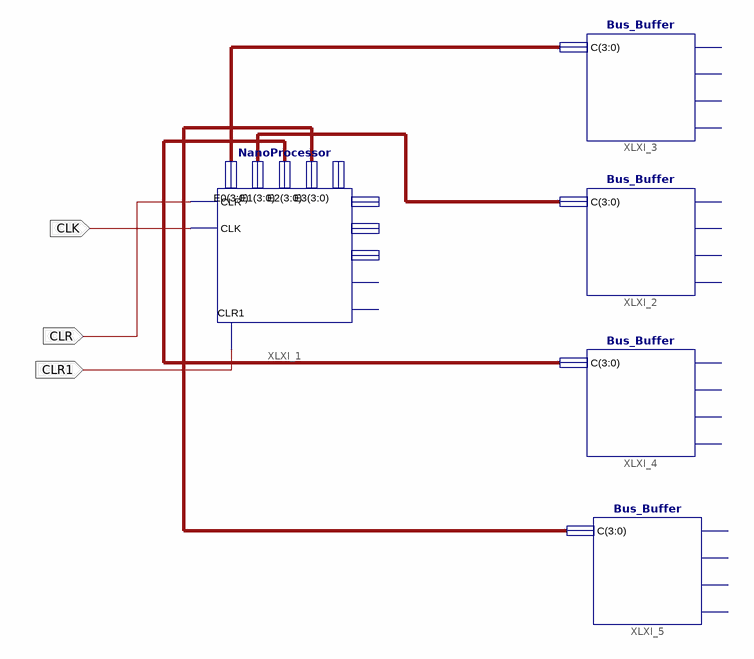
[diagram p0: schematic sheet 1]
// Xilinx ISE schematic NanoSevenSeg.sch (spartan3e) as structural Verilog: 5 symbols, 3 ports
module NanoSevenSeg (
  input  CLK,
  input  CLR1,
  input  CLR
);

  wire [3:0] XLXN_1, XLXN_2, XLXN_3, XLXN_4;

  NanoProcessor XLXI_1 (
    .CLR(CLR), .CLK(CLK), .CLR1(CLR1), .E1(XLXN_2), .E0(XLXN_1), .E2(XLXN_3), .E3(XLXN_4));  // open: C_Out, E4, E5, E6, Carry, E7
  Bus_Buffer XLXI_2 (.C(XLXN_2));  // open: E0, E1, E2, E3
  Bus_Buffer XLXI_3 (.C(XLXN_1));  // open: E0, E1, E2, E3
  Bus_Buffer XLXI_4 (.C(XLXN_3));  // open: E0, E1, E2, E3
  Bus_Buffer XLXI_5 (.C(XLXN_4));  // open: E0, E1, E2, E3
endmodule
